# EAGLE schematic PROCESSING UNIT (EAGLE 9.5.0)
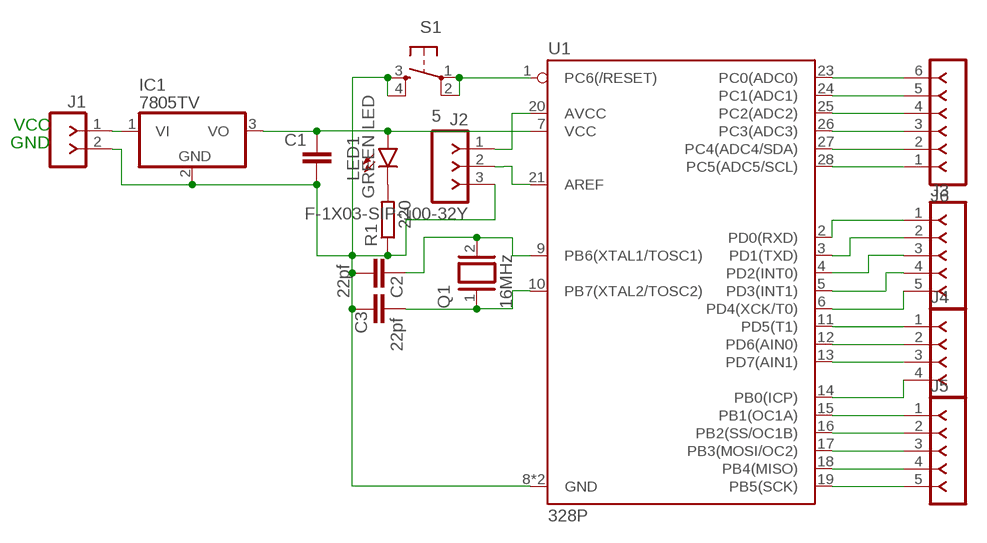
[diagram p0: schematic, sheet 1]

## Parts
C1  1uf  C-EU025-025X050  [C025-025X050]
C2  22pf  C-EU025-025X050  [C025-025X050]
C3  22pf  C-EU025-025X050  [C025-025X050]
IC1  7805TV  [TO220V]
J1  F-1X02-SIP-100-32Y  [SIP-100-02-32Y]
J2  F-1X03-SIP-100-32Y  [SIP-100-03-32Y]
J3  F-1X05-SIP-100-32Y  [SIP-100-05-32Y]
J4  F-1X04-SIP-100-32Y  [SIP-100-04-32Y]
J5  F-1X05-SIP-100-32Y  [SIP-100-05-32Y]
J6  F-1X06-SIP-100-32Y  [SIP-100-06-32Y]
LED1  GREEN LED  LEDSML0603  [SML0603]
Q1  16MHz  XTAL/S  [QS]
R1  220  R-EU_0204/7  [0204/7]
S1  5  TAC_SWITCHPTH  [TACTILE-PTH]
U1  328P  ATMEGA328P_PDIP  [DIP28]

## Nets
N$1: C1.2 C2.1 C3.1 IC1.2(GND) J1.2 J2.3 R1.1 S1.3 S1.4 U1.8(GND) U1.22(GND)
N$2: S1.1 S1.2 U1.1(PC6(/RESET))
N$3: LED1.C R1.2
N$4: C2.2 Q1.2 U1.9(PB6(XTAL1/TOSC1))
N$5: C1.1 IC1.3(VO) LED1.A U1.7(VCC)
N$6: IC1.1(VI) J1.1
N$7: C3.2 Q1.1 U1.10(PB7(XTAL2/TOSC2))
N$8: J2.1 U1.20(AVCC)
N$9: J2.2 U1.21(AREF)
N$10: J3.1 U1.2(PD0(RXD))
N$11: J3.2 U1.3(PD1(TXD))
N$12: J3.3 U1.4(PD2(INT0))
N$13: J3.4 U1.5(PD3(INT1))
N$14: J3.5 U1.6(PD4(XCK/T0))
N$15: J4.1 U1.11(PD5(T1))
N$16: J4.2 U1.12(PD6(AIN0))
N$17: J4.3 U1.13(PD7(AIN1))
N$18: J4.4 U1.14(PB0(ICP))
N$19: J5.1 U1.15(PB1(OC1A))
N$20: J5.2 U1.16(PB2(SS/OC1B))
N$21: J5.3 U1.17(PB3(MOSI/OC2))
N$22: J5.4 U1.18(PB4(MISO))
N$23: J5.5 U1.19(PB5(SCK))
N$24: J6.1 U1.28(PC5(ADC5/SCL))
N$25: J6.2 U1.27(PC4(ADC4/SDA))
N$26: J6.3 U1.26(PC3(ADC3))
N$27: J6.4 U1.25(PC2(ADC2))
N$28: J6.5 U1.24(PC1(ADC1))
N$29: J6.6 U1.23(PC0(ADC0))

## Notes on the sheet
- VCC
- GND

## Library data of the parts
C1-C3 = rcl:C-EU: CAPACITOR, European symbol; SPICEPREFIX: C
IC1 = linear:78*: Positive VOLTAGE REGULATOR Source: http://cache.national.com/ds/LM/LM78L05.pdf http://www.fairchildsemi.com/ds/LM/LM7805.pdf
J1 = con-headers-jp:F-1X02-: FEMALE HEADER
J2 = con-headers-jp:F-1X03-: FEMALE HEADER
J3 J5 = con-headers-jp:F-1X05-: FEMALE HEADER
J4 = con-headers-jp:F-1X04-: FEMALE HEADER
J6 = con-headers-jp:F-1X06-: FEMALE HEADER
LED1 = led:LED: LED OSRAM: - CHIPLED LG R971, LG N971, LY N971, LG Q971, LY Q971, LO R971, LY R971 LH N974, LH R974 LS Q976, LO Q976, LY Q976 LO Q996 - Hyper CHIPLED LW Q18S LB Q993, LB Q99A, LB R99A - SideLED LS A670, LO A670, LY A670, LG A670, LP A670 LB A673, LV A673, LT A673, LW A673 LH A674 LY A675 LS A676, LA A676, LO A676, LY A676, LW A676 LS A679, LY A679, LG A679 - Hyper Micro SIDELED® LS Y876, LA Y876, LO Y876, LY Y876 LT Y87S - SmartLED LW L88C, LW L88S LB L89C, LB L89S, LG L890 LS L89K, LO L89K, LY L89K LS L896, LA L896, LO L896, LY L896 - TOPLED LS T670, LO T670, LY T670, LG T670, LP T670 LSG T670, LSP T670, LSY T670, LOP T670, LYG T670 LG T671, LOG T671, LSG T671 LB T673, LV T673, LT T673, LW T673 LH T674 LS T676, LA T676, LO T676, LY T676, LB T676, LH T676, LSB T676, LW T676 LB T67C, LV T67C, LT T67C, LS T67K, LO T67K, LY T67K, LW E67C LS E67B, LA E67B, LO E67B, LY E67B, LB E67C, LV E67C, LT E67C LW T67C LS T679, LY T679, LG T679 LS T770, LO T770, LY T770, LG T770, LP T770 LB T773, LV T773, LT T773, LW T773 LH T774 LS E675, LA E675, LY E675, LS T675 LS T776, LA T776, LO T776, LY T776, LB T776 LHGB T686 LT T68C, LB T68C - Hyper Mini TOPLED® LB M676 - Mini TOPLED Santana® LG M470 LS M47K, LO M47K, LY M47K Source: http://www.osram.convergy.de LUXEON: - LUMILED® LXK2-PW12-R00, LXK2-PW12-S00, LXK2-PW14-U00, LXK2-PW14-V00 LXK2-PM12-R00, LXK2-PM12-S00, LXK2-PM14-U00 LXK2-PE12-Q00, LXK2-PE12-R00, LXK2-PE12-S00, LXK2-PE14-T00, LXK2-PE14-U00 LXK2-PB12-K00, LXK2-PB12-L00, LXK2-PB12-M00, LXK2-PB14-N00, LXK2-PB14-P00, LXK2-PB14-Q00 LXK2-PR12-L00, LXK2-PR12-M00, LXK2-PR14-Q00, LXK2-PR14-R00 LXK2-PD12-Q00, LXK2-PD12-R00, LXK2-PD12-S00 LXK2-PH12-R00, LXK2-PH12-S00 LXK2-PL12-P00, LXK2-PL12-Q00, LXK2-PL12-R00 Source: www.luxeon.com KINGBRIGHT: KA-3528ASYC Source: www.kingbright.com
Q1 = special:XTAL/S: CRYSTAL
R1 = rcl:R-EU_: RESISTOR, European symbol; SPICEPREFIX: R
S1 = SparkFun-Retired:TAC_SWITCH: Momentary Switch Button commonly used for reset or general input. Spark Fun Electronics SKU : COM-00097 SMT- SWCH-08247
U1 = SparkFun-IC-Microcontroller:ATMEGA328P_PDIP: Atmel 328P Through hole ATMEGA328P uC used in the Arduino 32kb flash, 1k EEPROM, 2k SRAM Datasheet <http://www.sparkfun.com/datasheets/Components/SMD/ATMega328.pdf> SparkFun Products Storefront component: AVR 28 Pin 20MHz 32K 6A/D - ATMega328P <https://www.sparkfun.com/products/9061> (COM-09061) SparkFun Simon Says - Through-Hole Soldering Kit <https://www.sparkfun.com/products/10547> (KIT-10547) SparkFun Learn to Solder - Simon Says <https://www.sparkfun.com/products/13708> (KIT-13708) SparkFun BigTime Watch Kit <https://www.sparkfun.com/products/11734> (KIT-11734) SparkFun ClockIt <https://www.sparkfun.com/products/10930> (KIT-10930) SparkFun Serial Enabled LCD Kit <https://www.sparkfun.com/products/10097> (LCD-10097) SparkFun Simon Tilts - Through Hole Soldering Kit <https://www.sparkfun.com/products/12634> (KIT-12634) SparkFun Frequency Counter Kit <https://www.sparkfun.com/products/10140> (KIT-10140) FabFM Radio Kit <https://www.sparkfun.com/products/11043> (KIT-11043) SparkFun Binary Blaster Kit <https://www.sparkfun.com/products/12037> (KIT-12037) SparkFun Metro-Gnome <https://www.sparkfun.com/products/9236> (KIT-09236) ATmega328 with Arduino Optiboot (Uno) <https://www.sparkfun.com/products/10524> (DEV-10524); PROD_ID: IC-09136